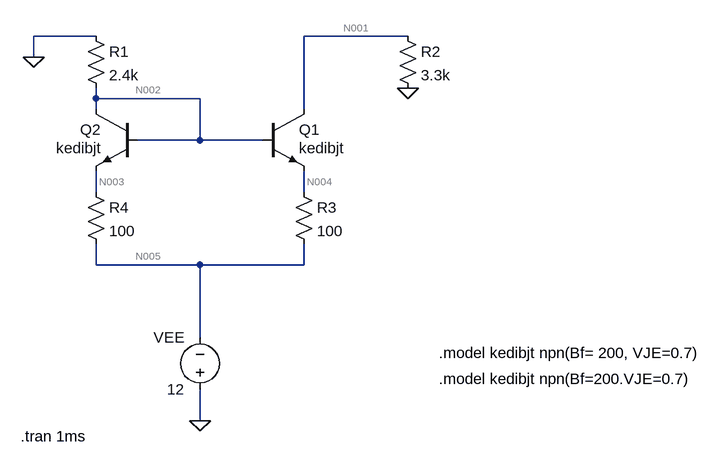
[diagram p0: schematic 7.1.asc]
7.1.asc, the LTspice schematic file:
Version 4
SHEET 1 988 736
WIRE -64 32 -160 32
WIRE 416 32 256 32
WIRE -160 64 -160 32
WIRE -64 128 -64 112
WIRE 96 128 -64 128
WIRE -64 144 -64 128
WIRE 256 144 256 32
WIRE 96 192 96 128
WIRE 96 192 0 192
WIRE 192 192 96 192
WIRE -64 272 -64 240
WIRE 256 272 256 240
WIRE -64 384 -64 352
WIRE 96 384 -64 384
WIRE 256 384 256 352
WIRE 256 384 96 384
WIRE 96 496 96 384
WIRE 96 624 96 576
FLAG -160 64 0
FLAG 416 112 0
FLAG 96 624 0
SYMBOL npn 192 144 R0
WINDOW 3 56 60 Left 2
SYMATTR InstName Q1
SYMATTR Value kedibjt
SYMBOL npn 0 144 M0
WINDOW 3 56 60 Left 2
SYMATTR InstName Q2
SYMATTR Value kedibjt
SYMBOL res -80 16 R0
SYMATTR InstName R1
SYMATTR Value 2.4k
SYMBOL res 400 16 R0
SYMATTR InstName R2
SYMATTR Value 3.3k
SYMBOL res 240 256 R0
SYMATTR InstName R3
SYMATTR Value 100
SYMBOL res -80 256 R0
SYMATTR InstName R4
SYMATTR Value 100
SYMBOL voltage 96 592 R180
WINDOW 0 24 96 Left 2
WINDOW 3 24 16 Left 2
SYMATTR InstName VEE
SYMATTR Value 12
TEXT 464 560 Left 2 !.model kedibjt npn(Bf=200.VJE=0.7)
TEXT 464 520 Left 2 !.model kedibjt npn(Bf= 200, VJE=0.7)
TEXT -180 648 Left 2 !.tran 1ms

The netlist it stands for:
* 7.1.asc
Q1 N001 N002 N004 0 kedibjt
Q2 N002 N002 N003 0 kedibjt
R1 0 N002 2.4k
R2 N001 0 3.3k
R3 N004 N005 100
R4 N003 N005 100
VEE 0 N005 12
.model NPN NPN
.model PNP PNP
.lib standard.bjt
.model kedibjt npn(Bf=200.VJE=0.7)
.model kedibjt npn(Bf= 200, VJE=0.7)
.tran 1ms
.backanno
.end

* Results of the author's LTspice run, read from the files saved beside the schematic
* Operating Point, zero values left out:
*   V(n001) = -11.54 V
*   V(n002) = -10.79 V
*   V(n004) = -11.6 V
*   V(n003) = -11.6 V
*   V(n005) = -12 V
*   Ic(Q2) = 3.99 mA
*   Ib(Q2) = 19.95 µA
*   Ie(Q2) = -4.01 mA
*   Ic(Q1) = 3.498 mA
*   Ib(Q1) = 485.4 µA
*   Ie(Q1) = -3.983 mA
*   I(R4) = 4.01 mA
*   I(R3) = 3.983 mA
*   I(R2) = -3.498 mA
*   I(R1) = 4.495 mA
*   I(Vee) = -7.993 mA